# EAGLE design RPiOperantBreakout (EAGLE 8.4.3)
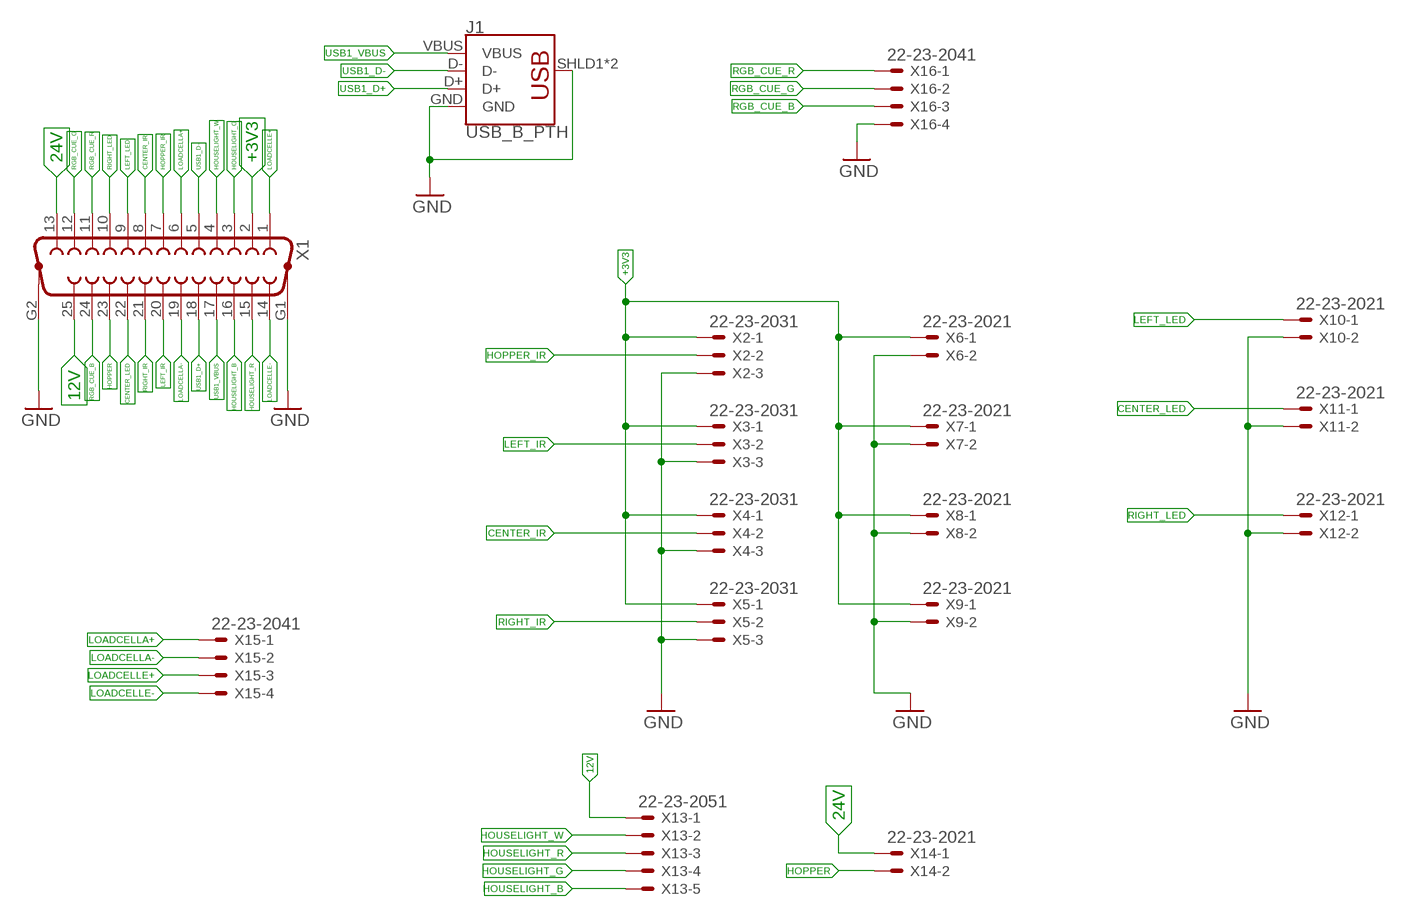
[diagram p0: schematic, sheet 1]

## Parts
J1  USB_B_PTH  [USB-B-PTH]
X1  F25HP  [F25HP]
X2  22-23-2031  [22-23-2031]
X3  22-23-2031  [22-23-2031]
X4  22-23-2031  [22-23-2031]
X5  22-23-2031  [22-23-2031]
X6  22-23-2021  [22-23-2021]
X7  22-23-2021  [22-23-2021]
X8  22-23-2021  [22-23-2021]
X9  22-23-2021  [22-23-2021]
X10  22-23-2021  [22-23-2021]
X11  22-23-2021  [22-23-2021]
X12  22-23-2021  [22-23-2021]
X13  22-23-2051  [22-23-2051]
X14  22-23-2021  [22-23-2021]
X15  22-23-2041  [22-23-2041]
X16  22-23-2041  [22-23-2041]

## Nets
12V [12V]: X1.25 X13.1
24V: X1.13 X14.1
+3V3: X1.2 X2.1 X3.1 X4.1 X5.1 X6.1 X7.1 X8.1 X9.1
CENTER_IR: X1.8 X4.2
CENTER_LED: X1.22 X11.1
GND: J1.GND J1.SHLD1(SHIELD) J1.SHLD2(SHIELD) X1.G1 X1.G2 X2.3 X3.3 X4.3 X5.3 X6.2 X7.2 X8.2 X9.2 X10.2 X11.2 X12.2 X16.4
HOPPER [12V]: X1.23 X14.2
HOPPER_IR: X1.7 X2.2
HOUSELIGHT_B [12V]: X1.16 X13.5
HOUSELIGHT_G [12V]: X1.3 X13.4
HOUSELIGHT_R [12V]: X1.15 X13.3
HOUSELIGHT_W [12V]: X1.4 X13.2
LEFT_IR: X1.20 X3.2
LEFT_LED: X1.9 X10.1
LOADCELLA+: X1.6 X15.1
LOADCELLA-: X1.19 X15.2
LOADCELLE+: X1.1 X15.3
LOADCELLE-: X1.14 X15.4
RGB_CUE_B: X1.24 X16.3
RGB_CUE_G: X1.12 X16.2
RGB_CUE_R: X1.11 X16.1
RIGHT_IR: X1.21 X5.2
RIGHT_LED: X1.10 X12.1
USB1_D+: J1.D+ X1.18
USB1_D-: J1.D- X1.5
USB1_VBUS: J1.VBUS X1.17

## Library data of the parts
J1 = SparkFun-Connectors:USB_B: USB Type B Connector SparkFun Products: SparkFun Stepoko <https://www.sparkfun.com/products/13899> PTH; PROD_ID: CONN-08278; SF_ID: PRT-00139
X1 = con-subd:F25HP: SUB-D; OC_FARNELL: unknown; OC_NEWARK: unknown
X2-X5 = con-molex:22-23-2031: .100" (2.54mm) Center Header - 3 Pin; MF: MOLEX; MPN: 22-23-2031; OC_FARNELL: 1462950; OC_NEWARK: 30C0862
X6-X12 X14 = con-molex:22-23-2021: .100" (2.54mm) Center Header - 2 Pin; MF: MOLEX; MPN: 22-23-2021; OC_FARNELL: 1462926; OC_NEWARK: 25C3832
X13 = con-molex:22-23-2051: .100" (2.54mm) Center Header - 5 Pin; MF: MOLEX; MPN: 22-23-2051; OC_FARNELL: 1462952; OC_NEWARK: 38C9178
X15 X16 = con-molex:22-23-2041: .100" (2.54mm) Center Header - 4 Pin; MF: MOLEX; MPN: 22-23-2041; OC_FARNELL: 1462920; OC_NEWARK: 38C0355

## Net classes
0 default: width 0.305 mm, clearance 0.254 mm
1 12V: width 1.372 mm, clearance 0.254 mm

## Board
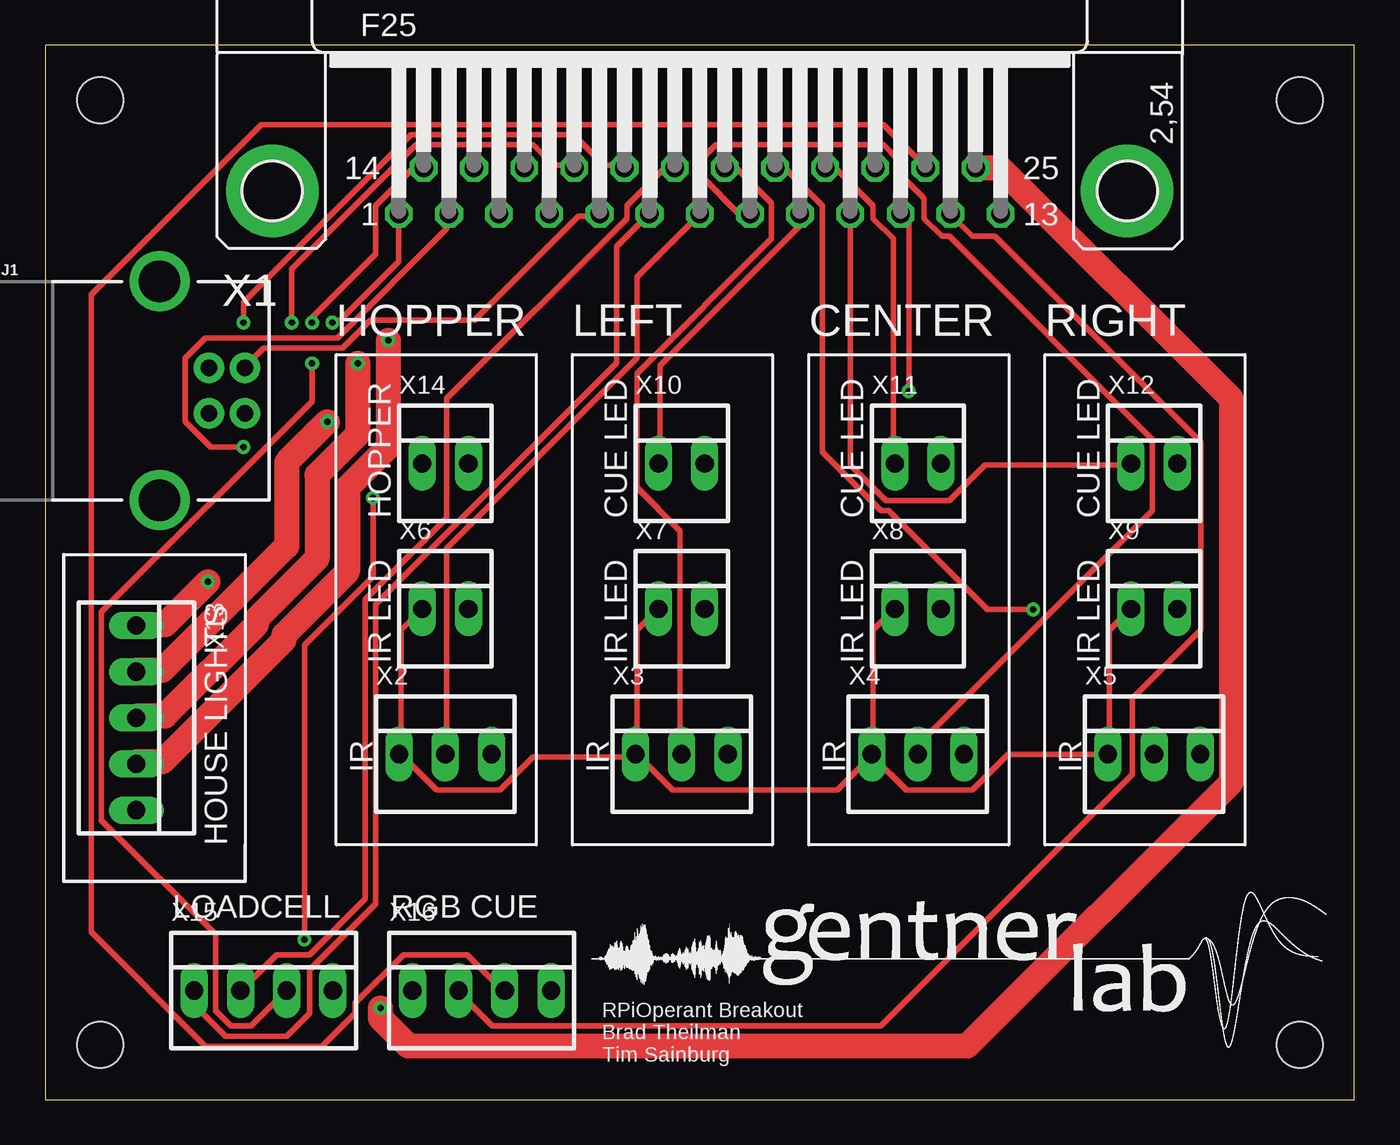
[diagram p1: board, top side]
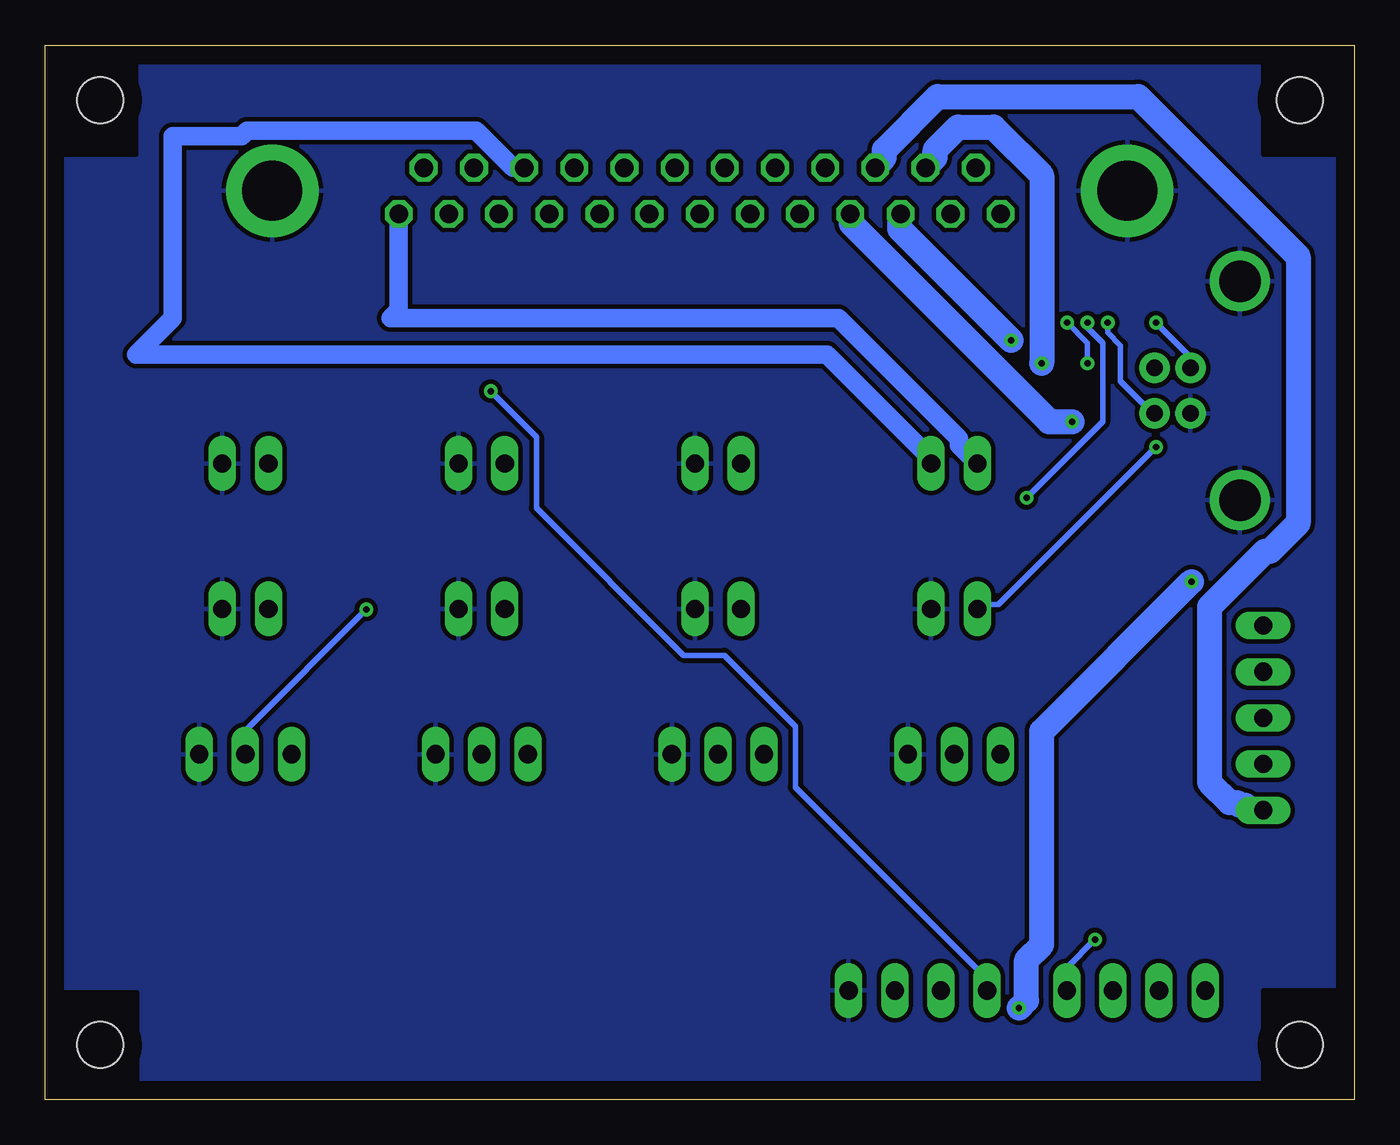
[diagram p2: board, bottom side, seen from below]

Size 72 x 58 mm. Coordinates in mm from the lower left corner, seen from the top.
Outline: 0,0 72,0 72,58 0,58 0,0
Copper layers (1*16): Top 0.035mm / dielectric 1.5mm / Bottom 0.035mm
Design rules "default": minimum track width 6mil, minimum drill 0.35mm, track to track 6mil, track to pad 6mil, pad to pad 6mil, via to via 6mil, smd to smd 6mil, copper to edge 40mil, drill to drill 6mil, minimum pad ring 10mil, minimum via ring 8mil, stop-mask expansion 4mil, vias tented up to drill 0mil, thermal gap 10mil
Holes 2.54 mm at 3,55 69,55 69,3 3,3
tRestrict: area 1,1 to 5,6; area 67,52 to 71,57; area 1,52 to 5,57; area 66.9,0.9 to 70.9,5.9
bRestrict: area 1,52 to 5,57; area 1,1 to 5,6; area 67,52 to 71,57; area 66.9,0.9 to 70.9,5.9

### Footprints (pad centres in the part's own frame; a part is rotated, then mirrored left to right if it is on the bottom)
USB-B-PTH = drill 0.914 pad 1.676: D+ 4,1.25; D- 5.981,1.25; GND 4,-1.25; VBUS 5.981,-1.25 | drill 2.286: SHLD1 1.282,-6.02; SHLD2 1.282,6.02
F25HP = drill 1.016 octagon: 1 -16.561,-1.27; 2 -13.792,-1.27; 3 -11.049,-1.27; 4 -8.28,-1.27; 5 -5.512,-1.27; 6 -2.769,-1.27; 7 0,-1.27; 8 2.769,-1.27; 9 5.512,-1.27; 10 8.28,-1.27; 11 11.049,-1.27; 12 13.792,-1.27; 13 16.561,-1.27; 14 -15.189,1.27; 15 -12.421,1.27; 16 -9.652,1.27; 17 -6.909,1.27; 18 -4.14,1.27; 19 -1.372,1.27; 20 1.372,1.27; 21 4.14,1.27; 22 6.909,1.27; 23 9.652,1.27; 24 12.421,1.27; 25 15.189,1.27 | drill 3.302 pad 5.08: G1 -23.52,0; G2 23.52,0
22-23-2031 = drill 1 long: 1 -2.54,0; 2 0,0; 3 2.54,0
22-23-2021 = drill 1 long: 1 -1.27,0; 2 1.27,0
22-23-2051 = drill 1 long: 1 -5.08,0; 2 -2.54,0; 3 0,0; 4 2.54,0; 5 5.08,0
22-23-2041 = drill 1 long: 1 -3.81,0; 2 -1.27,0; 3 1.27,0; 4 3.81,0

### Placement (x,y rotation side)
J1  5,39 0 top
X1  36,50 0 top
X2  22,19 0 top
X3  35,19 0 top
X4  48,19 0 top
X5  61,19 0 top
X6  22,27 0 top
X7  35,27 0 top
X8  48,27 0 top
X9  61,27 0 top
X10  35,35 0 top
X11  48,35 0 top
X12  61,35 0 top
X13  5,21 270 top
X14  22,35 0 top
X15  12,6 0 top
X16  24,6 0 top

### Tracks (layer width: path | path; a pad name or v marks a point on that pad's centre or on a via)
12V  (via drill 0.35)
  Top 1.372: v8.94,28.5 6.57,26.12 5.03,26.12 X13.1 | v18.44,5.03 18.44,4.47 19.98,2.93 50.71,2.93 65.24,17.46 65.24,38.56 52.53,51.27 51.27,51.27 X1.25
  Bottom 1.372: v8.94,28.5 17.18,20.26 17.18,8.52 18.02,7.68 18.02,5.45 v18.44,5.03
24V
  Bottom 1.016: X14.1 21.75,36.02 21.75,36.38 28.37,43 53,43 52.56,43.44 X1.13
+3V3  (via drill 0.35)
  Top 0.305: X9.1 59.65,26.96 58.53,25.84 58.53,19.14 X5.1 58.4,19 52.95,19 50.99,17.04 47.36,17.04 45.54,18.86 X4.1 | X3.1 32.55,19.14 32.55,25.84 33.67,26.96 X7.1 | X4.1 45.54,19.14 45.54,25.84 46.66,26.96 X8.1 | X3.1 32.55,19 34.51,17.04 43.59,17.04 45.4,18.86 X4.1 | X6.1 20.68,26.96 19.56,25.84 19.56,19.14 X2.1 19.56,19 21.51,17.04 25.01,17.04 26.82,18.86 32.41,18.86 X3.1 | v10.9,35.9 9.08,35.9 7.68,37.3 7.68,40.79 8.8,41.91 16.07,41.91 22.07,47.92 22.07,48.62 X1.2
  Bottom 0.305: v10.9,35.9 19.56,27.24 20.54,27.24 20.68,27.1 X6.1
CENTER_IR
  Top 0.305: X4.2 48.06,19.14 48.06,19.56 60.91,32.41 60.91,36.32 49.73,47.5 49.31,47.5 48.34,48.48 48.34,49.59 46.94,50.99 46.94,51.69 46.1,52.53 36.88,52.53 36.18,51.83 36.18,50.71 38.14,48.76 38.7,48.76 X1.8
CENTER_LED
  Top 0.305: X11.1 46.66,35.06 46.66,47.36 45.54,48.48 45.54,49.17 43.45,51.27 43.03,51.27 X1.22
GND
  pour Bottom: 1,57 1,1 71,1 71,57
HOPPER
  Bottom 1.016: X14.2 23.27,35.27 29,41 67,41 65,43 65,53 61.19,53 60.89,53.3 48.3,53.3 46.27,51.27 X1.23
HOPPER_IR
  Top 0.305: X2.2 22.07,19.14 22.07,30.32 32.55,40.79 32.55,45.26 35.9,48.62 X1.7
HOUSELIGHT_B
  Bottom 1.372: X13.5 5.03,15.93 5.73,15.93 6.01,16.2 6.29,16.2 6.43,16.34 6.84,16.34 7.96,17.46 7.96,27.1 4.89,30.18 4.61,30.18 3.07,31.71 3.07,46.38 11.87,55.18 22.91,55.18 25.84,52.25 25.84,51.83 26.26,51.41 X1.16
HOUSELIGHT_G  (via drill 0.35)
  Top 1.372: v18.86,41.77 18.86,35.9 16.62,33.67 16.62,29.06 13.13,25.57 13.13,25.29 6.43,18.58 5.03,18.58 X13.4
  Bottom 1.372: v18.86,41.77 25.01,47.92 25.01,48.62 X1.3
HOUSELIGHT_R  (via drill 0.35)
  Top 1.372: v17.18,40.51 17.18,36.6 14.95,34.37 14.95,29.76 11.6,26.4 11.6,26.12 6.57,21.09 5.03,21.09 X13.3
  Bottom 1.372: v17.18,40.51 17.18,50.85 19.84,53.51 21.79,53.51 23.05,52.25 23.05,51.83 23.47,51.41 X1.15
HOUSELIGHT_W  (via drill 0.35)
  Top 1.372: v15.51,37.3 13.27,35.06 13.27,30.45 6.43,23.61 5.03,23.61 X13.2
  Bottom 1.372: v15.51,37.3 16.76,37.3 27.66,48.2 27.66,48.62 X1.4
LEFT_IR
  Top 0.305: X3.2 34.92,19.14 34.92,31.29 32.55,33.67 32.55,39.95 39.95,47.36 39.95,49.31 38,51.27 37.44,51.27 X1.20
LEFT_LED
  Top 0.305: X10.1 33.81,35.06 33.81,40.37 41.49,48.06 41.49,48.62 X1.9
LOADCELLA+
  Top 0.305: X15.1 8.24,5.87 8.24,5.17 9.92,3.49 13.27,3.49 14.53,4.75 14.53,7.12 18.16,10.76 18.16,27.24 31.43,40.51 31.43,46.94 33.11,48.62 X1.6
LOADCELLA-
  Top 0.305: X15.2 10.76,6.01 12.71,7.96 14.53,7.96 17.6,11.04 17.6,27.52 22.07,31.99 22.07,38.56 31.99,48.48 31.99,49.17 34.09,51.27 34.51,51.27 X1.19
LOADCELLE+  (via drill 0.35)
  Top 0.305: v14.67,40.51 14.67,38.42 3.07,26.82 3.07,15.37 9.36,9.08 9.36,4.89 10.2,4.05 11.32,4.05 13.13,5.87 X15.3 | v15.79,42.75 16.07,42.75 19.42,46.1 19.42,48.62 X1.1
  Bottom 0.305: v14.67,40.51 14.67,41.63 v15.79,42.75
LOADCELLE-  (via drill 0.35)
  Top 0.305: v14.25,8.8 14.25,25.01 18.02,28.78 v18.02,33.11 | v14.67,42.75 14.67,43.03 18.16,46.52 18.16,49.17 20.26,51.27 20.68,51.27 X1.14
  Bottom 0.305: v14.25,8.8 15.79,7.26 15.79,6.01 X15.4 | v18.02,33.11 13.83,37.3 13.83,41.63 14.67,42.47 v14.67,42.75
RGB_CUE_B
  Top 0.305: X16.3 25.15,6.01 23.19,7.96 19.7,7.96 17.04,5.31 17.04,4.75 15.23,2.93 8.8,2.93 2.52,9.22 2.52,44.28 11.87,53.65 46.1,53.65 48.34,51.41 X1.24
RGB_CUE_G
  Top 0.305: X16.2 22.77,5.87 24.59,4.05 45.96,4.05 59.79,17.88 59.79,22.07 63.56,25.84 63.56,36.18 52.25,47.5 50.99,47.5 49.87,48.62 X1.12
RGB_CUE_R  (via drill 0.35)
  Top 0.305: v47.5,38.98 47.5,48.2 47.08,48.62 X1.11
  Bottom 0.305: v47.5,38.98 44.98,36.46 44.98,32.55 36.88,24.45 34.65,24.45 30.73,20.54 30.73,17.18 20.26,6.71 20.26,6.01 X16.1
RIGHT_IR  (via drill 0.35)
  Top 0.305: v54.34,26.96 51.83,26.96 46.38,32.41 45.96,32.41 42.75,35.62 42.75,49.17 40.65,51.27 40.23,51.27 X1.21
  Bottom 0.305: v54.34,26.96 60.91,20.4 60.91,19.14 X5.2
RIGHT_LED
  Top 0.305: X12.1 59.65,34.92 51.69,34.92 49.73,32.97 46.24,32.97 44.28,34.92 44.28,48.62 X1.10
USB1_D+  (via drill 0.35)
  Top 0.305: v10.9,42.75 10.9,43.87 20.12,53.09 29.06,53.09 30.73,51.41 31.85,51.41 X1.18
  Bottom 0.305: v10.9,42.75 9.08,40.93 9.08,40.37 J1.D+
USB1_D-
  Top 0.305: X1.5 30.45,48.62 29.34,48.62 23.61,42.89 17.88,42.89 16.34,41.35 12.01,41.35 11.04,40.37 J1.D-
USB1_VBUS  (via drill 0.35)
  Top 0.305: v13.55,42.75 13.55,45.68 20.4,52.53 26.82,52.53 27.94,51.41 29.06,51.41 X1.17
  Bottom 0.305: v13.55,42.75 13.55,42.19 12.85,41.49 12.85,39.53 11.04,37.72 J1.VBUS

### Text on the board
tPlace: HOPPER | LEFT | CENTER | RIGHT | HOPPER | CUE LED | CUE LED | CUE LED | IR LED | IR LED | IR LED | IR LED | IR | IR | IR | IR | HOUSE LIGHTS | LOADCELL | RGB CUE | RPiOperant Breakout / Brad Theilman / Tim Sainburg
200bmp: /home/brad/Pictures/gentnerlab_logo_inverted.bmp